# EAGLE design ai_avr_synth (EAGLE 6.5.0)
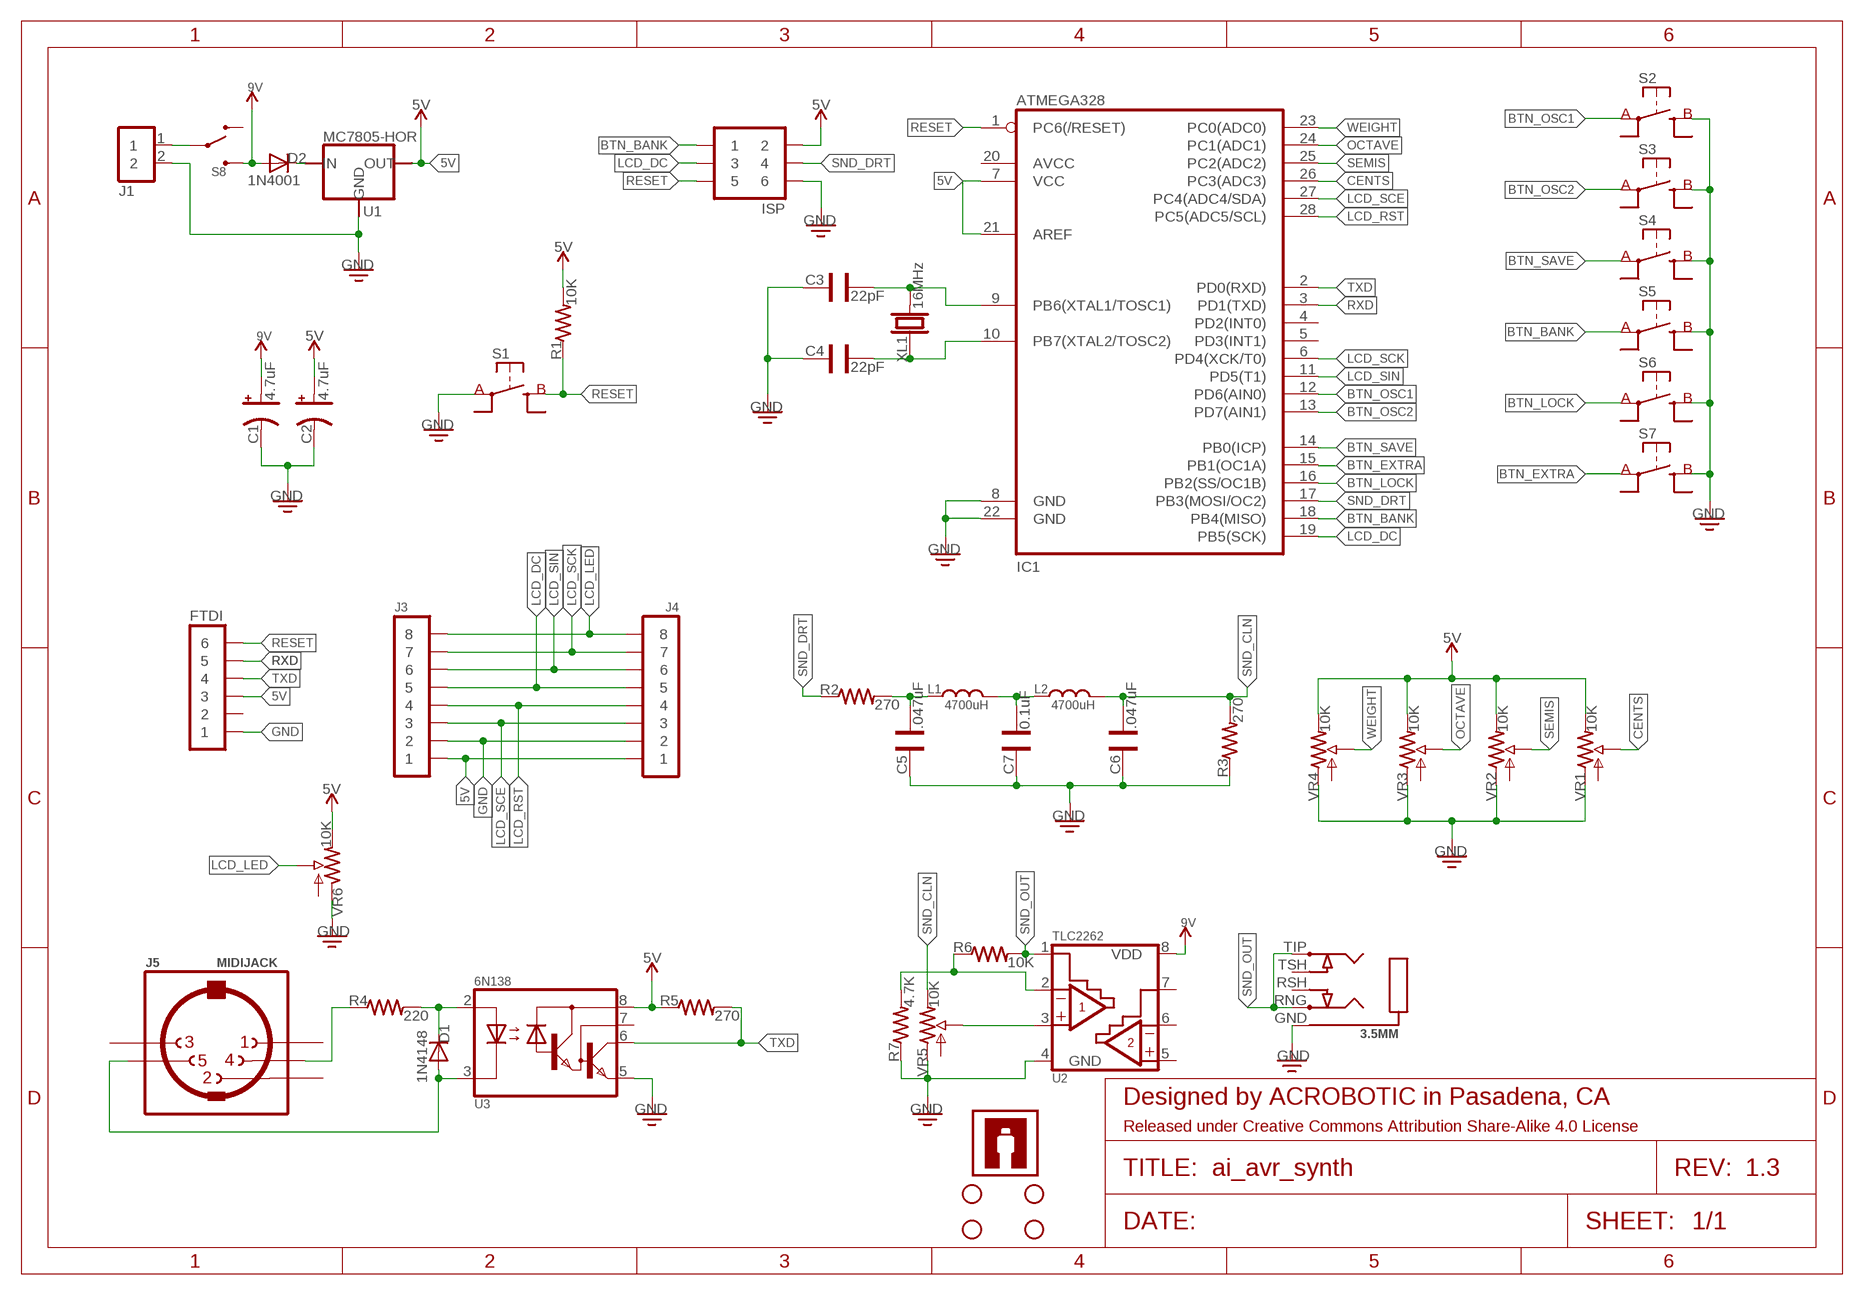
[diagram p0: schematic, sheet 1]

## Parts
3.5MM  STEREOJACKSJ1-351XNG  [SJ1-351XNG]
C1  4.7uF  CAP-POL025X50  [CAP-POL-025X50]
C2  4.7uF  CAP-POL025X50  [CAP-POL-025X50]
C3  22pF  CAP025X050  [CAP-025X050]
C4  22pF  CAP025X050  [CAP-025X050]
C5  .047uF  CAP025X050  [CAP-025X050]
C6  .047uF  CAP025X050  [CAP-025X050]
C7  0.1uF  CAP025X050  [CAP-025X050]
D1  1N4148  DIODETH-1N914  [TH-1N914]
D2  1N4001  DIODETH-1N914  [TH-1N914]
FRAME1  FRAME-LETTER  [CREATIVE-COMMONS]
FTDI  1X06  [1X06]
IC1  ATMEGA328P-PDIP  [DIL28]
ISP  2X03  [2X03]
J1  1X02ST  [1X02-ST]
J3  1X08  [1X08]
J4  1X08  [1X08]
J5  MIDIJACK  [CP-2350]
L1  4700uH  INDRLB0912  [RLB0912]
L2  4700uH  INDRLB0912  [RLB0912]
R1  10K  RESAXIAL-0.4  [RES-AXIAL-0.4]
R2  270  RESAXIAL-0.4  [RES-AXIAL-0.4]
R3  270  RESAXIAL-0.4  [RES-AXIAL-0.4]
R4  220  RESAXIAL-0.4  [RES-AXIAL-0.4]
R5  270  RESAXIAL-0.4  [RES-AXIAL-0.4]
R6  10K  RESAXIAL-0.4  [RES-AXIAL-0.4]
R7  4.7K  RESAXIAL-0.4  [RES-AXIAL-0.4]
S1  SW-SPSTTH06X06  [SW-SPST-TH06X06]
S2  SW-SPSTTH06X06  [SW-SPST-TH06X06]
S3  SW-SPSTTH06X06  [SW-SPST-TH06X06]
S4  SW-SPSTTH06X06  [SW-SPST-TH06X06]
S5  SW-SPSTTH06X06  [SW-SPST-TH06X06]
S6  SW-SPSTTH06X06  [SW-SPST-TH06X06]
S7  SW-SPSTTH06X06  [SW-SPST-TH06X06]
S8  SW-SPDTTH  [SW-SPDT-TH]
STANDOFF5  STAND-OFF4  [STAND-OFF-4]
STANDOFF6  STAND-OFF4  [STAND-OFF-4]
STANDOFF7  STAND-OFF4  [STAND-OFF-4]
STANDOFF8  STAND-OFF4  [STAND-OFF-4]
U1  MC7805-HOR  [TO220]
U2  TLC2262  [DIL08]
U3  6N138  [DIL08]
U$5  AI-LOGOXS  [AI-LOGO-XS]
VR1  10K  POT09X09  [POT-09X09]
VR2  10K  POT09X09  [POT-09X09]
VR3  10K  POT09X09  [POT-09X09]
VR4  10K  POT09X09  [POT-09X09]
VR5  10K  POT09X09  [POT-09X09]
VR6  10K  POT05X05  [POT-05X05]
XL1  16MHz  CRYSTALHC49S  [HC49S]

## Nets
5V [PWR]: C2.A FTDI.3 IC1.7(VCC) IC1.21(AREF) ISP.2 J3.1 J4.1 R1.P$2 R5.P$1 U1.OUT U3.8(VCC) VR1.P$1(E) VR2.P$1(E) VR3.P$1(E) VR4.P$1(E) VR6.1(E)
9V [PWR]: C1.A D2.A S8.3(L2) U2.8(VDD)
BTN_BANK: IC1.18(PB4(MISO)) ISP.1 S5.A@1(A)
BTN_EXTRA: IC1.15(PB1(OC1A)) S7.A@1(A)
BTN_LOCK: IC1.16(PB2(SS/OC1B)) S6.A@1(A)
BTN_OSC1: IC1.12(PD6(AIN0)) S2.A@1(A)
BTN_OSC2: IC1.13(PD7(AIN1)) S3.A@1(A)
BTN_SAVE: IC1.14(PB0(ICP)) S4.A@1(A)
CENTS: IC1.26(PC3(ADC3)) VR1.P$2(S)
GND: 3.5MM.GND C1.C C2.C C3.2 C4.2 C5.2 C6.2 C7.2 FTDI.1 IC1.8(GND) IC1.22(GND) ISP.6 J1.2 J3.2 J4.2 R3.P$1 R7.P$1 S1.A@1(A) S2.B@1(B) S3.B@1(B) S4.B@1(B) S5.B@1(B) S6.B@1(B) S7.B@1(B) U1.GND U2.4(GND) U3.5(GND) VR1.P$3(A) VR2.P$3(A) VR3.P$3(A) VR4.P$3(A) VR5.P$3(A) VR6.3(A)
LCD_DC: IC1.19(PB5(SCK)) ISP.3 J3.5 J4.5
LCD_LED: J3.8 J4.8 VR6.2(S)
LCD_RST: IC1.28(PC5(ADC5/SCL)) J3.4 J4.4
LCD_SCE: IC1.27(PC4(ADC4/SDA)) J3.3 J4.3
LCD_SCK: IC1.6(PD4(XCK/T0)) J3.7 J4.7
LCD_SIN: IC1.11(PD5(T1)) J3.6 J4.6
N$1: J5.4 R4.P$1
N$3: C4.1 IC1.10(PB7(XTAL2/TOSC2)) XL1.1
N$4: C3.1 IC1.9(PB6(XTAL1/TOSC1)) XL1.2
N$5: J1.1 S8.2(COM)
N$7: D2.C U1.IN
N$9: D1.C R4.P$2 U3.2(A)
N$10: D1.A J5.5 U3.3(C)
N$11: U2.3(1IN+) VR5.P$2(S)
N$12: C5.1 L1.2 R2.P$2
N$13: C7.1 L1.1 L2.2
N$15: R6.P$1 R7.P$2 U2.2(1IN-)
OCTAVE: IC1.24(PC1(ADC1)) VR3.P$2(S)
RESET: FTDI.6 IC1.1(PC6(/RESET)) ISP.5 R1.P$1 S1.B@1(B)
RXD: FTDI.5 IC1.3(PD1(TXD))
SEMIS: IC1.25(PC2(ADC2)) VR2.P$2(S)
SND_CLN: C6.1 L2.1 R3.P$2 VR5.P$1(E)
SND_DRT: IC1.17(PB3(MOSI/OC2)) ISP.4 R2.P$1
SND_OUT: 3.5MM.RNG 3.5MM.TIP R6.P$2 U2.1(1OUT)
TXD: FTDI.4 IC1.2(PD0(RXD)) R5.P$2 U3.6(VO)
WEIGHT: IC1.23(PC0(ADC0)) VR4.P$2(S)
Unconnected: 3.5MM.RSH 3.5MM.TSH FTDI.2 IC1.4(PD2(INT0)) IC1.5(PD3(INT1)) IC1.20(AVCC) J5.1 J5.2 J5.3 S8.1(L1) U2.5(2IN+) U2.6(2IN-) U2.7(2OUT) U3.7(VB)

## Library data of the parts
3.5MM = Ai_Connectors:STEREOJACK: MIC/HEADPHONE JACK Stereo jack with two switches. Kycon STX3100, CUI SJ1-3555NG and/or 4UCon 05544
C1 C2 = Ai_Passives:CAP-POL: Polarized Capacitor Normally 10uF, 47uF, and 100uF in electrolytic and tantalum varieties.
C3-C7 = Ai_Passives:CAP
D1 D2 = Ai_DiscreteSemis:DIODE
FRAME1 = Ai_Miscellany:FRAME-LETTER: Schematic Frame A4 (8.5x11) US Letter frame based on the built-in A4-LOC frame.; REV: 1.3
FTDI = Ai_Connectors:1X06
IC1 = Ai_IC:ATMEGA328P-PDIP: ATMega328p Microcontroller used in the Arduino Uno R3. Dual In-line package 28-pin version.
ISP = Ai_Connectors:2X03
J1 = Ai_Connectors:1X02
J3 J4 = Ai_Connectors:1X08
J5 = Ai_Connectors:MIDIJACK: MIDI connector with strain relief (DIN-5 female)
L1 L2 = Ai_Passives:IND
R1-R7 = Ai_Passives:RES: Part # blah Digikey
S1-S7 = Ai_Electromechanical:SW-SPST
S8 = Ai_Electromechanical:SW-SPDT
STANDOFF5-STANDOFF8 = Ai_Electromechanical:STAND-OFF: Size #4
U1 = Ai_Power:MC7805: LDO voltage regulator in TO-220 package.
U2 = Ai_IC:TLC2262: Dual OP-AMP Standard dual package.
U3 = Ai_IC:6N138: Single-Channel Optocoupler Single-channel optocoupler comprising an AlGaAs LED optically coupled to a high-gain split darlington photodetector.
U$5 = Ai_Miscellany:AI-LOGO
VR1-VR6 = Ai_Passives:POT
XL1 = Ai_FrequencyControl:CRYSTAL: Cylinder: CMR200T-32.768KDZBT

## Net classes
0 default: width 0.406 mm
1 PWR: width 0.61 mm

## Board
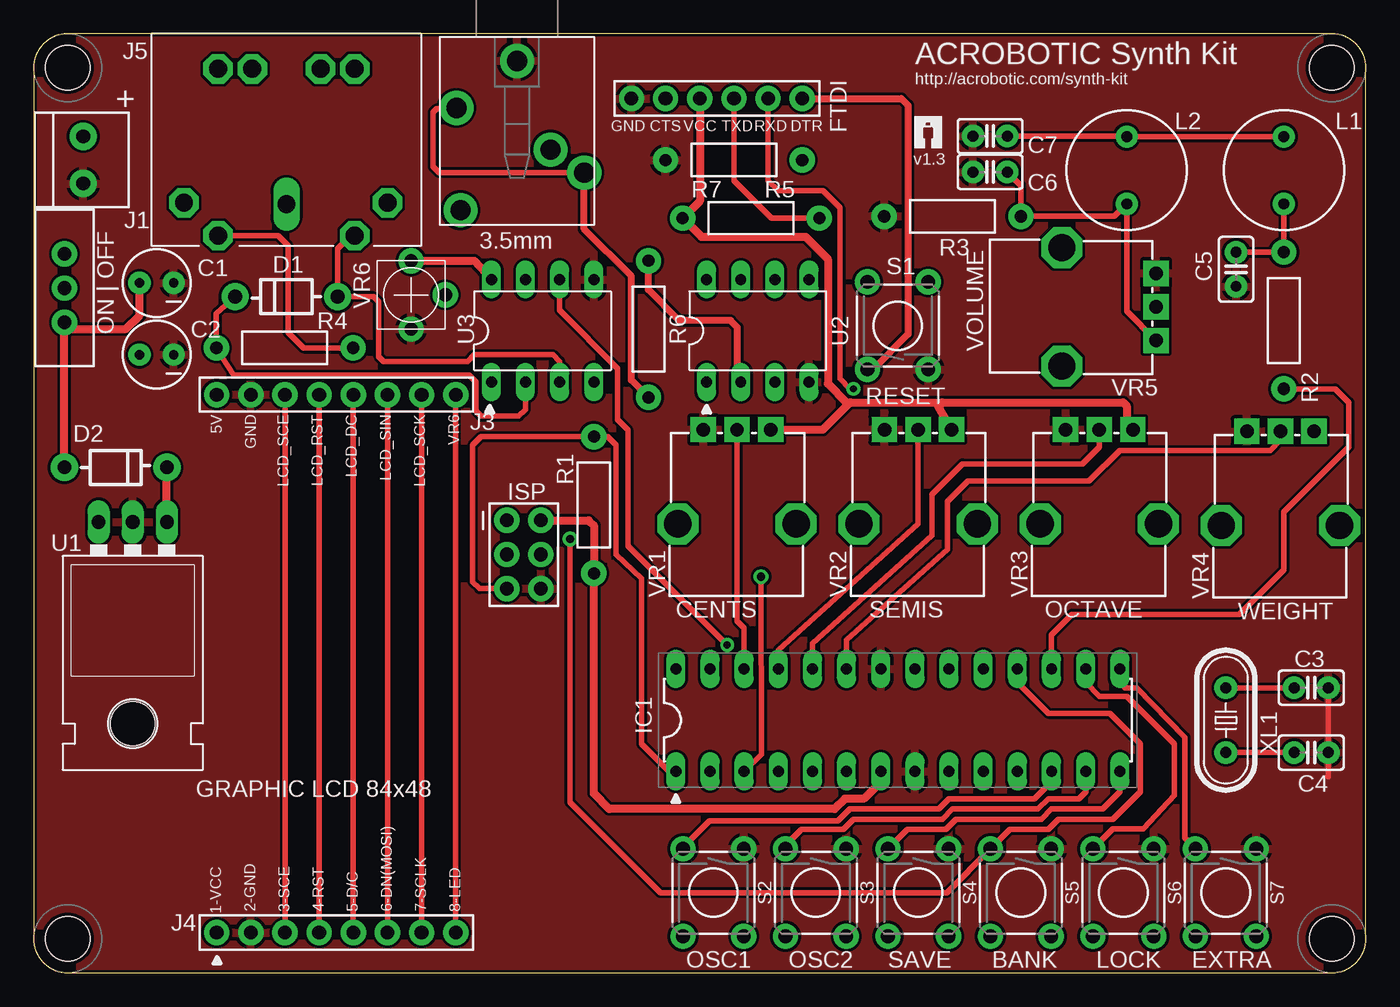
[diagram p1: board, top side]
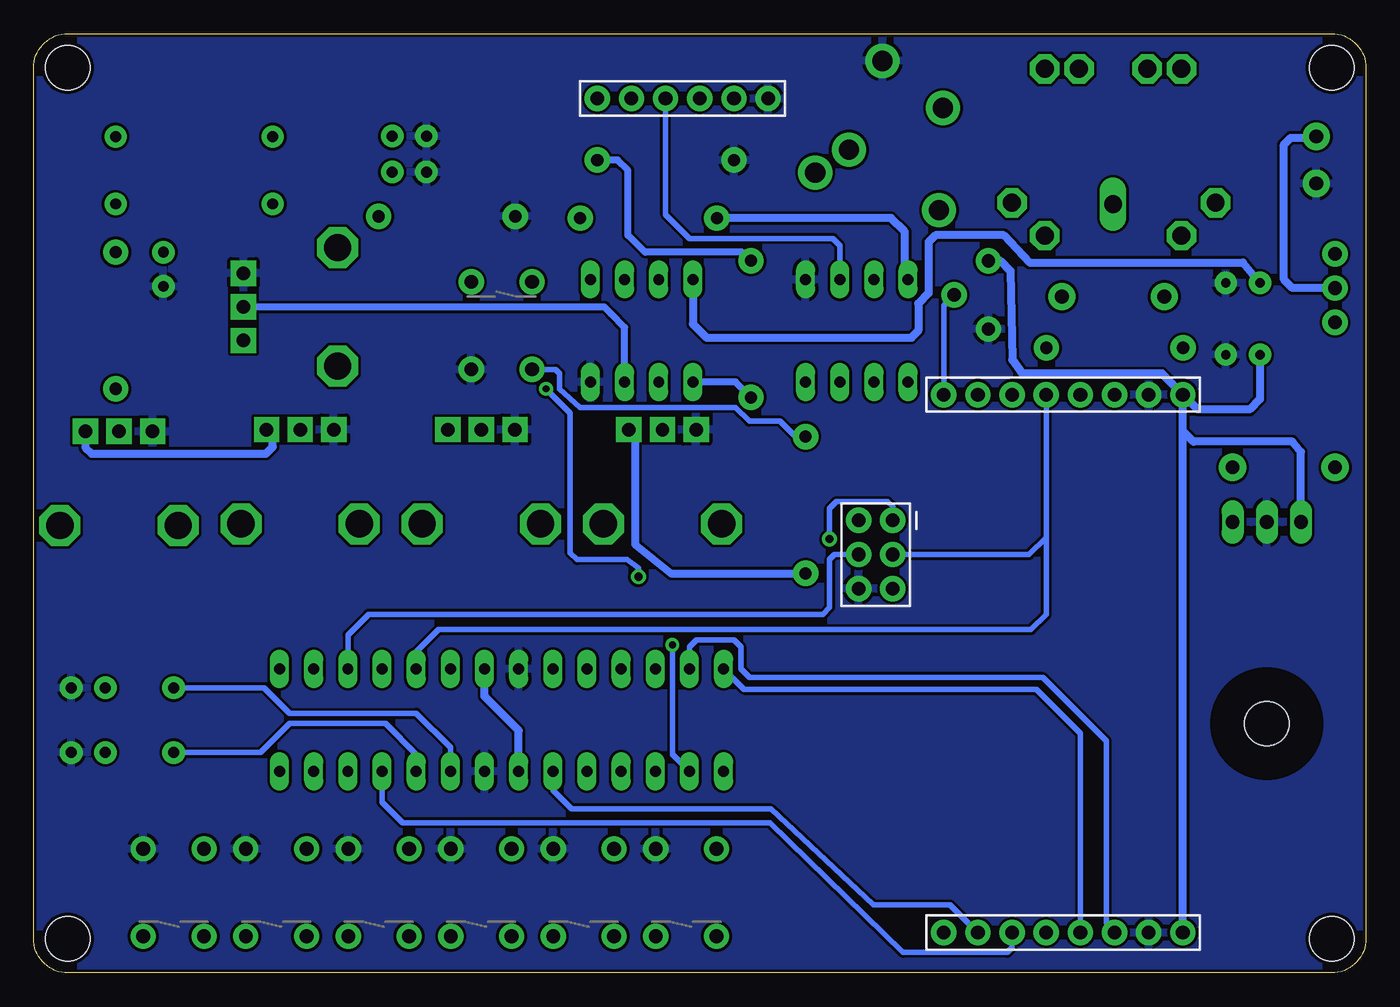
[diagram p2: board, bottom side, seen from below]

Size 99.06 x 69.85 mm. Coordinates in mm from the lower left corner, seen from the top.
Outline: 2.54,0 96.52,0 arc90 99.06,2.54 99.06,67.31 arc90 96.52,69.85 2.54,69.85 arc90 0,67.31 0,2.54 arc90 2.54,0
Copper layers (1*16): Top 0.035mm / dielectric 1.5mm / Bottom 0.035mm
Design rules "ai_2layer": minimum track width 7mil, minimum drill 15mil, track to track 8mil, track to pad 8mil, pad to pad 8mil, via to via 8mil, smd to smd 8mil, copper to edge 8mil, drill to drill 8mil, minimum pad ring 12mil, minimum via ring 10mil, stop-mask expansion 4mil, vias tented up to drill 20mil, thermal gap 10mil

### Footprints (pad centres in the part's own frame; a part is rotated, then mirrored left to right if it is on the bottom)
SJ1-351XNG = drill 1.5 pad 2.54: GND 0,0; RNG 8.3,5; RSH 6.6,2.5; TIP 3.5,-4.5; TSH 11.1,-4.2
CAP-POL-025X50 = drill 0.7 pad 1.651: A 1.27,0; C -1.27,0
CAP-025X050 = drill 0.813 pad 1.676: 1 -1.27,0; 2 1.27,0
TH-1N914 = drill 1.016 pad 2.032: A -3.81,0; C 3.81,0
1X06 = drill 1.016 pad 1.88: 1 -6.35,0; 2 -3.81,0; 3 -1.27,0; 4 1.27,0; 5 3.81,0; 6 6.35,0
DIL28 = drill 0.813 pad 1.422 long: 1 -16.51,-3.81; 2 -13.97,-3.81; 3 -11.43,-3.81; 4 -8.89,-3.81; 5 -6.35,-3.81; 6 -3.81,-3.81; 7 -1.27,-3.81; 8 1.27,-3.81; 9 3.81,-3.81; 10 6.35,-3.81; 11 8.89,-3.81; 12 11.43,-3.81; 13 13.97,-3.81; 14 16.51,-3.81; 15 16.51,3.81; 16 13.97,3.81; 17 11.43,3.81; 18 8.89,3.81; 19 6.35,3.81; 20 3.81,3.81; 21 1.27,3.81; 22 -1.27,3.81; 23 -3.81,3.81; 24 -6.35,3.81; 25 -8.89,3.81; 26 -11.43,3.81; 27 -13.97,3.81; 28 -16.51,3.81
2X03 = drill 1.016 pad 1.88: 1 -2.54,-1.27; 2 -2.54,1.27; 3 0,-1.27; 4 0,1.27; 5 2.54,-1.27; 6 2.54,1.27
1X02-ST = drill 1.016 pad 2.032: 1 -1.75,0; 2 1.75,0
1X08 = drill 1.016 pad 1.88: 1 -8.89,0; 2 -6.35,0; 3 -3.81,0; 4 -1.27,0; 5 1.27,0; 6 3.81,0; 7 6.35,0; 8 8.89,0
CP-2350 = drill 1.321 pad 2.184 octagon: 1 7.62,12.58; 3 -7.52,12.58; 4 5.08,15.02; 5 -5.08,15.02; PE1 -5.08,2.62; PE2 5.08,2.62; PE3 -2.54,2.62; PE4 2.54,2.62 | drill 1.321 long: 2 0,12.68
RLB0912 = drill 0.813 pad 1.651: 1 2.502,0; 2 -2.502,0
RES-AXIAL-0.4 = drill 0.9 pad 1.88: P$1 -5.08,0; P$2 5.08,0
SW-SPST-TH06X06 = drill 1.016 pad 1.88: A@1 -3.251,-2.261; A@2 3.251,-2.261; B@1 -3.251,2.261; B@2 3.251,2.261
SW-SPDT-TH = drill 1.016 pad 1.88: 1 0,2.54; 2 0,0; 3 0,-2.54
STAND-OFF-4 = hole 3.302: 0,0
TO220 = drill 1.016 pad 1.422 long: GND 0,-6.985; IN -2.54,-6.985; OUT 2.54,-6.985 | hole 3.302: 0,8.001
DIL08 = drill 0.813 pad 1.27 long: 1 -3.81,-3.81; 2 -1.27,-3.81; 3 1.27,-3.81; 4 3.81,-3.81; 5 3.81,3.81; 6 1.27,3.81; 7 -1.27,3.81; 8 -3.81,3.81
POT-09X09 = drill 1 pad 1.88 square: P$1 6.365,-2.5; P$2 6.365,0; P$3 6.365,2.5 | drill 2.032 pad 3.048 octagon: P$4 -0.635,-4.4; P$5 -0.635,4.4
POT-05X05 = drill 1 pad 1.88: 1 -2.54,0; 2 0,2.54; 3 2.54,0
HC49S = drill 0.813 pad 1.676: 1 -2.413,0; 2 2.413,0

### Placement (x,y rotation side)
3.5MM  35.94,67.82 270 top
C1  9.14,51.31 180 top
C2  9.14,45.97 180 top
C3  95,21.21 0 top
C4  95,16.38 0 top
C5  89.41,52.32 270 top
C6  71.12,59.56 180 top
C7  71.12,62.23 180 top
D1  18.8,50.29 180 top
D2  6.1,37.59 0 top
FRAME1  52.07,-1.27 0 top
FTDI  50.8,65.02 0 top
IC1  64.26,18.8 0 top
ISP  36.45,31.11 270 top
J1  3.68,60.45 270 top
J3  22.5,43 0 top
J4  22.5,3 0 top
J5  18.8,69.85 180 top
L1  92.96,59.69 90 top
L2  81.28,59.69 270 top
R1  41.66,34.8 270 top
R2  92.96,48.51 90 top
R3  68.33,56.26 0 top
R4  18.67,46.48 180 top
R5  53.34,56.13 0 top
R6  45.72,47.88 270 top
R7  52.07,60.45 0 top
S1  64.26,48.13 90 top
S2  50.55,5.97 270 top
S3  58.17,5.97 270 top
S4  65.79,5.97 270 top
S5  73.41,5.97 270 top
S6  81.03,5.97 270 top
S7  88.65,5.97 270 top
S8  2.29,50.93 0 top
STANDOFF5  2.54,67.31 0 top
STANDOFF6  2.54,2.54 0 top
STANDOFF7  96.52,2.54 0 top
STANDOFF8  96.52,67.31 0 top
U1  7.37,26.54 180 top
U2  53.85,47.75 0 top
U3  37.85,47.75 0 top
U$5  65.53,61.34 0 top
VR1  52.3,34.04 90 top
VR2  65.77,34.04 90 top
VR3  79.24,34.04 90 top
VR4  92.71,33.91 90 top
VR5  77.09,49.53 0 top
VR6  28.07,50.42 270 top
XL1  88.65,18.8 90 top

### Tracks (layer width: path | path; a pad name or v marks a point on that pad's centre or on a via)
5V
  Top 0.61: VR1.P$1 58.68,40.4 60.7,42.42 | IC1.7 62.99,14.22 61.72,12.95 60.33,12.95 59.56,12.19 42.8,12.19 41.66,13.34 R1.P$2 41.66,33.27 41.27,33.66 ISP.2 | 60.7,42.42 60.45,42.42 59.05,43.81 59.05,53.09 57.4,54.74 49.66,54.74 R5.P$1 49.53,57.4 FTDI.3 | 60.7,42.42 67.56,42.42 | 67.56,42.42 81.03,42.42 81.28,42.16 81.28,40.7 VR3.P$1 | VR2.P$1 67.27,42.12 67.56,42.42 | VR6.1 32.77,52.96 U3.8
  Bottom 0.61: IC1.7 62.99,18.03 65.53,20.57 IC1.21 | R1.P$2 51.68,29.72 54.33,31.87 54.33,40.19 54.55,40.4 VR1.P$1 | U1.OUT 4.83,38.73 5.46,39.5 12.83,39.5 13.61,40.28 | J4.1 13.61,40.28 | 13.61,40.28 J3.1 | VR4.P$1 95.21,39.08 94.74,38.61 81.79,38.61 81.28,39.12 81.28,40.36 VR3.P$1 | C2.A 7.87,42.67 8.64,41.91 12.5,41.91 J3.1 | J3.1 15.17,44.58 25.53,44.58 26.29,45.59 26.42,52.2 27.18,52.96 VR6.1 | U3.8 34.29,51.82 34.29,55.12 35.31,56.13 R5.P$1
9V
  Top 0.61: D2.A S8.3 2.79,47.88 6.86,47.88 7.87,48.9 C1.A
  Bottom 0.61: U2.8 50.04,48.26 49.02,47.24 33.78,47.24 33.27,47.75 33.27,49.78 32.51,50.55 32.51,54.36 32,54.86 26.92,54.86 25.02,52.83 9.14,52.83 C1.A
BTN_BANK  (via drill 0.6)
  Top 0.406: IC1.18 73.15,21.59 75.44,19.3 80.01,19.3 82.3,17.02 82.3,13.46 80.26,11.43 76.2,11.43 75.44,10.67 72.59,10.67 S5.A@1 67.89,5.97 46.61,5.97 39.88,12.7 v39.88,32.26
  Bottom 0.406: v39.88,32.26 39.88,34.54 39.37,35.05 35.56,35.05 35.18,34.67 ISP.1
BTN_EXTRA
  Top 0.406: IC1.15 80.77,21.59 81.15,21.21 82.04,21.21 85.6,17.53 85.6,10.03 86.39,9.25 S7.A@1
BTN_LOCK
  Top 0.406: IC1.16 78.23,21.59 79.25,20.57 81.28,20.57 84.84,17.02 84.84,13.21 82.51,10.71 80.25,10.71 S6.A@1
BTN_OSC1
  Top 0.406: IC1.12 75.69,14.22 74.42,12.95 68.07,12.95 67.31,12.19 60.71,12.19 59.82,11.3 50.24,11.3 48.28,9.35 S2.A@1
BTN_OSC2
  Top 0.406: IC1.13 78.23,13.46 77.72,12.95 75.44,12.95 74.68,12.19 68.33,12.19 67.56,11.43 60.96,11.43 60.2,10.67 57.1,10.67 55.91,9.47 S3.A@1
BTN_SAVE
  Top 0.406: IC1.14 80.77,13.46 79.5,12.19 75.69,12.19 74.93,11.43 68.58,11.43 67.82,10.67 64.97,10.67 S4.A@1
CENTS
  Top 0.406: IC1.26 52.83,25.65 52.3,26.19 VR1.P$2
GND
  Top 0.406: C3.2 C4.2 96.27,14.58
  pour Top: 0,69.85 99.06,69.85 99.06,0 0,0
  pour Bottom: 0,69.85 99.06,69.85 99.06,0 0,0
LCD_DC
  Top 0.406: J3.5 J4.5
  Bottom 0.406: IC1.19 70.61,23.88 68.96,25.53 24.89,25.53 23.77,26.65 23.77,32.38 | 23.77,32.38 J3.5 | ISP.3 25.04,31.11 23.77,32.38
LCD_LED
  Top 0.406: J4.8 J3.8
  Bottom 0.406: VR6.2 31.37,49.64 J3.8
LCD_RST
  Top 0.406: J3.4 J4.4
  Bottom 0.406: IC1.28 46.23,21.08 24.51,21.08 21.23,17.8 J4.4
LCD_SCE
  Top 0.406: J3.3 J4.3
  Bottom 0.406: J4.3 19.3,3.74 19.3,17.27 24,21.97 45.85,21.97 46.48,22.61 46.48,24.26 46.99,24.77 49.78,24.77 50.29,24.26 IC1.27
LCD_SCK
  Top 0.406: J3.7 J4.7
  Bottom 0.406: IC1.6 60.45,13.59 59.05,12.19 44.25,12.19 36.63,5.06 30.91,5.06 J4.7
LCD_SIN
  Top 0.406: J4.6 J3.6
  Bottom 0.406: IC1.11 73.15,12.7 71.63,11.18 44.32,11.18 34.42,1.52 26.66,1.52 26.31,1.87 J4.6
N$1
  Top 0.406: R4.P$1 20.07,46.48 18.92,47.62 18.92,54.1 18.2,54.83 J5.4
N$3
  Top 0.406: XL1.1 C4.1
  Bottom 0.406: XL1.1 82.17,16.38 80.01,18.54 72.9,18.54 70.61,16.26 IC1.10
N$4
  Top 0.406: XL1.2 C3.1
  Bottom 0.406: IC1.9 68.07,16.76 70.61,19.3 80.01,19.3 81.92,21.21 XL1.2
N$5
  Bottom 0.61: S8.2 5.46,50.93 6.1,51.56 6.1,61.59 5.59,62.1 3.71,62.1 J1.1
N$7
  Top 0.61: U1.IN D2.C
N$9
  Top 0.406: D1.C 13.59,49.02 R4.P$2 14.86,44.45 32.38,44.45 32.89,43.94 32.89,41.78 33.27,41.4 36.07,41.4 36.58,41.91 U3.2
N$10
  Top 0.406: J5.5 23.57,54.83 22.61,53.87 D1.A 25.27,50.29 25.65,49.91 25.65,45.85 26.04,45.47 32.26,45.47 32.77,45.97 38.61,45.97 39.12,45.47 U3.3
N$11
  Bottom 0.508: U2.3 55.12,48.01 56.13,49.02 56.63,49.52 71.11,49.52 VR5.P$2
N$12
  Top 0.406: L1.2 R2.P$2 C5.1
N$13
  Top 0.406: C7.1 81.24,62.23 L2.2 L1.1
N$15
  Top 0.508: U2.2 52.32,44.2 52.32,48.01 51.82,48.51 48.01,48.51 45.72,50.8 R6.P$1
  Bottom 0.508: R6.P$1 46.35,53.59 53.59,53.59 54.86,54.86 54.86,59.69 55.63,60.45 R7.P$2
OCTAVE
  Top 0.406: IC1.24 57.91,24.51 66.79,32.51 66.79,35.56 69.07,37.85 77.97,37.85 79.24,39.12 VR3.P$2
RESET
  Top 0.406: IC1.1 47.24,14.99 45.21,17.02 45.21,29.34 43.31,31.11 43.31,39.24 42.67,39.88 R1.P$1 33.27,39.88 32.64,39.24 32.64,29.08 33.15,28.57 ISP.5
  Top 0.508: FTDI.6 64.52,65.02 65.02,64.52 65.02,47.5 62.41,44.88 S1.B@1
  Bottom 0.406: S1.B@1 60.25,44.88 59.94,44.58 59.94,43.43 58.42,42.04 46.86,42.04 45.85,41.02 43.56,41.02 42.42,39.88 R1.P$1
RXD  (via drill 0.51, 0.6)
  Top 0.406: FTDI.5 54.61,58.93 55.37,58.17 58.67,58.17 59.94,56.9 59.94,44.2 60.71,43.43 v60.96,43.43 | v54.09,29.46 54.1,16.26 IC1.3
  Bottom 0.406: 60.96,43.18 v60.96,43.43 59.16,41.63 59.16,31.24 58.65,30.73 54.92,30.73 54.09,30.1 v54.09,29.46
SEMIS
  Top 0.406: VR2.P$2 65.77,33.4 55.37,24 IC1.25
SND_CLN
  Top 0.406: C6.1 73.41,58.55 R3.P$2 80.35,56.26 L2.1 81.28,49.2 VR5.P$1
SND_DRT
  Top 0.406: R2.P$1 96.77,43.43 97.79,42.42 97.79,39.12 92.96,34.29 92.96,29.97 89.66,26.67 77.22,26.67 75.69,25.15 IC1.17
  Bottom 0.406: ISP.4 39.5,31.11 39.88,30.73 39.88,27.18 40.39,26.67 74.17,26.67 75.69,25.15 IC1.17
SND_OUT
  Top 0.406: 3.5MM.TIP 31.39,64.26 29.97,64.26 29.72,64.01 29.72,59.94 30.14,59.52 3.5MM.RNG
  Top 0.508: R6.P$2 44.45,44.07 44.45,51.82 40.94,55.33 3.5MM.RNG
  Bottom 0.508: R6.P$2 46.86,43.94 U2.1
TXD  (via drill 0.51)
  Top 0.406: FTDI.4 52.07,58.93 54.86,56.13 R5.P$2 | U3.6 39.12,49.28 43.43,44.96 43.43,41.15 44.2,40.39 44.2,31.75 v51.56,24.38
  Bottom 0.406: v51.56,24.38 51.56,16.26 IC1.2 | U3.6 39.12,54.1 39.62,54.61 50.29,54.61 52.07,56.39 FTDI.4
WEIGHT
  Top 0.406: IC1.23 60.45,24.77 67.93,31.5 67.93,35.05 69.45,36.58 78.48,36.58 80.76,38.86 91.95,38.86 92.71,39.62 VR4.P$2

### Text on the board
tPlace: ACROBOTIC Synth Kit | http://acrobotic.com/synth-kit | + | GND | CTS | VCC | TXD | RXD | DTR | v1.3 | 3.5mm | ON | OFF | VOLUME | 5V | GND | LCD_SCE | LCD_RST | LCD_DC | LCD_SIN | LCD_SCK | VR6 | RESET | CENTS | SEMIS | OCTAVE | WEIGHT | GRAPHIC LCD 84x48 | 2-GND | 3-SCE | 4-RST | 5-D/C | 6-DN(MOSI) | 7-SCLK | 8-LED | 1-VCC | OSC1 | OSC2 | SAVE | BANK | LOCK | EXTRA
tDocu: @MakerBro